# EasyEDA schematic Water Sensor.json
TITLE: Sheet_1; REV: 1.0; Date: 2020-12-30; Sheet: 1/1; Company: Your Company
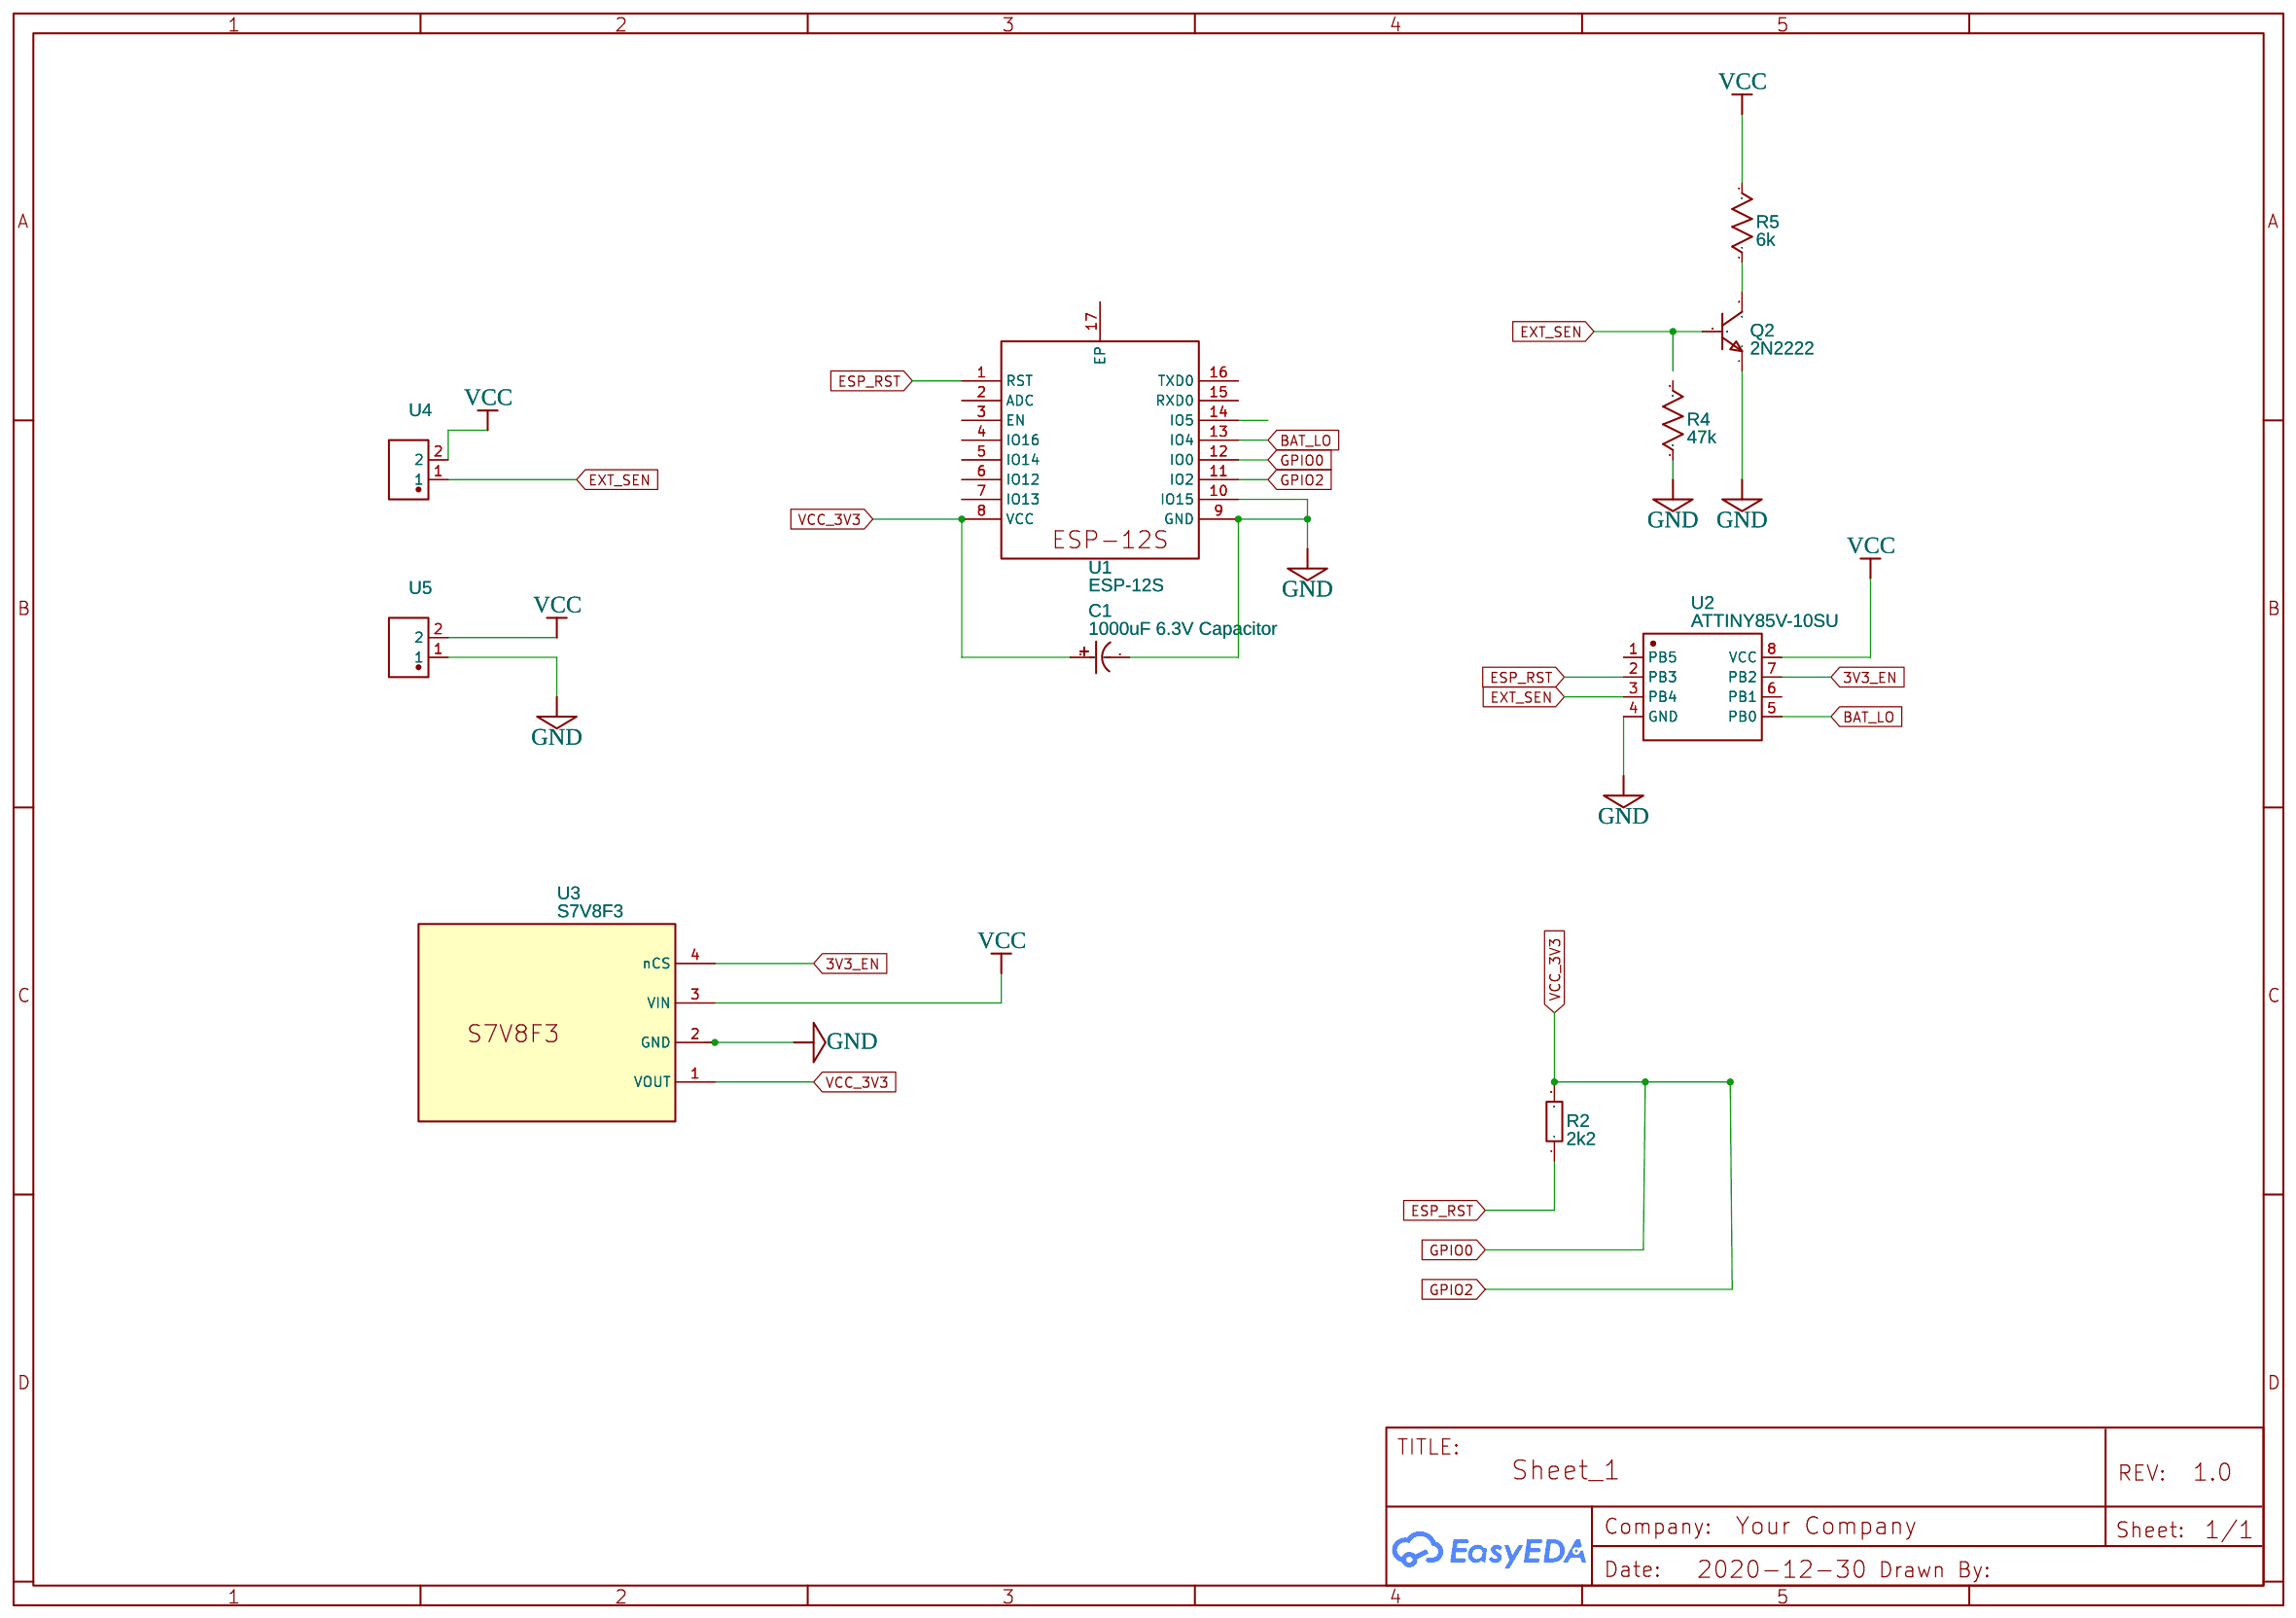
[diagram p0: schematic sheet]

## Parts
C1  1000uF 6.3V Capacitor  [1000UF 6.3V CAPACITOR]
Q2  2N2222  [TO-92-3_L4.9-W3.7-P1.27-L]
R2  2k2  [AXIAL-0.5]
R4  47k  [R0603]
R5  6k  [R0603]
U1  ESP-12S  [WIRELM-SMD_ESP-12S]
U2  ATTINY85V-10SU  [SOIC-8_L5.3-W5.3-P1.27-LS8.0-BL]
U3  S7V8F3  [S7V8F3]
U4  XY301V-A-5.0-2P  [CONN-TH_XY301V-A-5.0-2P]
U5  XY301V-A-5.0-2P  [CONN-TH_XY301V-A-5.0-2P]

## Library data of the parts
C1 = 1000uF 6.3V Capacitor: Contributor: l0_0t
Q2 = 2N2222: Supplier: LCSC; Manufacturer: SEMTECH; Contributor: LCSC; Supplier Part: C118536; LCSC Assembly: Yes; SMT Type: Extend
R2 = 2k2: Power: 1/2W; Tolerance: ±5%; EasyEDA: C69874; Supplier Part: C69874; Supplier: EasyEDA; Manufacturer Part: CFR02SJ0220A10
R4 R5 = R_0603_US: Contributor: LCEDA_Lib
U1 = ESP-12S: Supplier: LCSC; Manufacturer: Ai-Thinker; Contributor: LCSC; Supplier Part: C82898
U2 = ATTINY85V-10SU: Supplier: LCSC; Supplier Part: C152192; Manufacturer: Microchip Tech; Contributor: LCSC; SMT Type: Extend; JLCPCB SMD: Yes
U3 = S7V8F3: Contributor: winter2015; sourceId: YsmgyP7pj
U4 U5 = XY301V-A-5.0-2P: Supplier: LCSC; Supplier Part: C557651; Manufacturer: --; Contributor: LCSC

## Nets
3V3_EN: U2.7(PB2) U3.4(nCS)
GND: C1.2 Q2.1(E) R4.1 U1.9(GND) U1.10(IO15) U2.4(GND) U3.2(GND) U5.1
VCC: R5.2 U2.8(VCC) U3.3(VIN) U4.2 U5.2
BAT_LO: U1.13(IO4) U2.5(PB0)
ESP_RST: R2.1 U1.1(RST) U2.2(PB3)
EXT_SEN: Q2.2(B) U2.3(PB4) U4.1
GPIO0: C1.1 R2.2 U1.8(VCC) U1.11(IO2) U1.12(IO0) U3.1(VOUT)
Net-(Q2-3): Q2.3(C) R5.1

Not connected (* = marked no-connect by the designer): R4 2; U1 2(ADC) 3(EN) 4(IO16) 5(IO14) 6(IO12) 7(IO13) 14(IO5) 15(RXD0) 16(TXD0) 17(EP); U2 1(PB5) 6(PB1)
